# Altium schematic sheet ЦТЕА4.324.039_Э3_4.SchDoc
size 420 x 297 mm; ApprovedBy: Соколов; CheckedBy: Крушинская; DrawnBy: Бунтов; DocumentNumber: ЦТЕА4.324.039 Э3; SheetNumber: 3; SheetTotal: 4; Title1str: Плата управления; Title2str: и индикации телеметрии; ProcessInspection: Кудряшова; DocumentType1str: Схема электрическая; DocumentType2str: принципиальная; PageSetup: Record=PageOptionsZCenterHorizontal=TrueZCenterVertical=TrueZPrintScale=0.70ZXCorrection=1.00ZYCorrection=1.00ZPrintKind=1ZBorderSize=5000000ZLeftOffset=0ZBottomOffset=0ZOrientation=2ZPaperLength=2970ZPaperWidth=4200ZScale=100ZPaperSource=7ZPrintQuality=300ZMediaType=1ZDitherType=10ZPaperKind=Custom SizeZPrintScaleMode=1; ImagePath: ЦТЕА4.324.039; Rule: PcbType=ProtelPcb
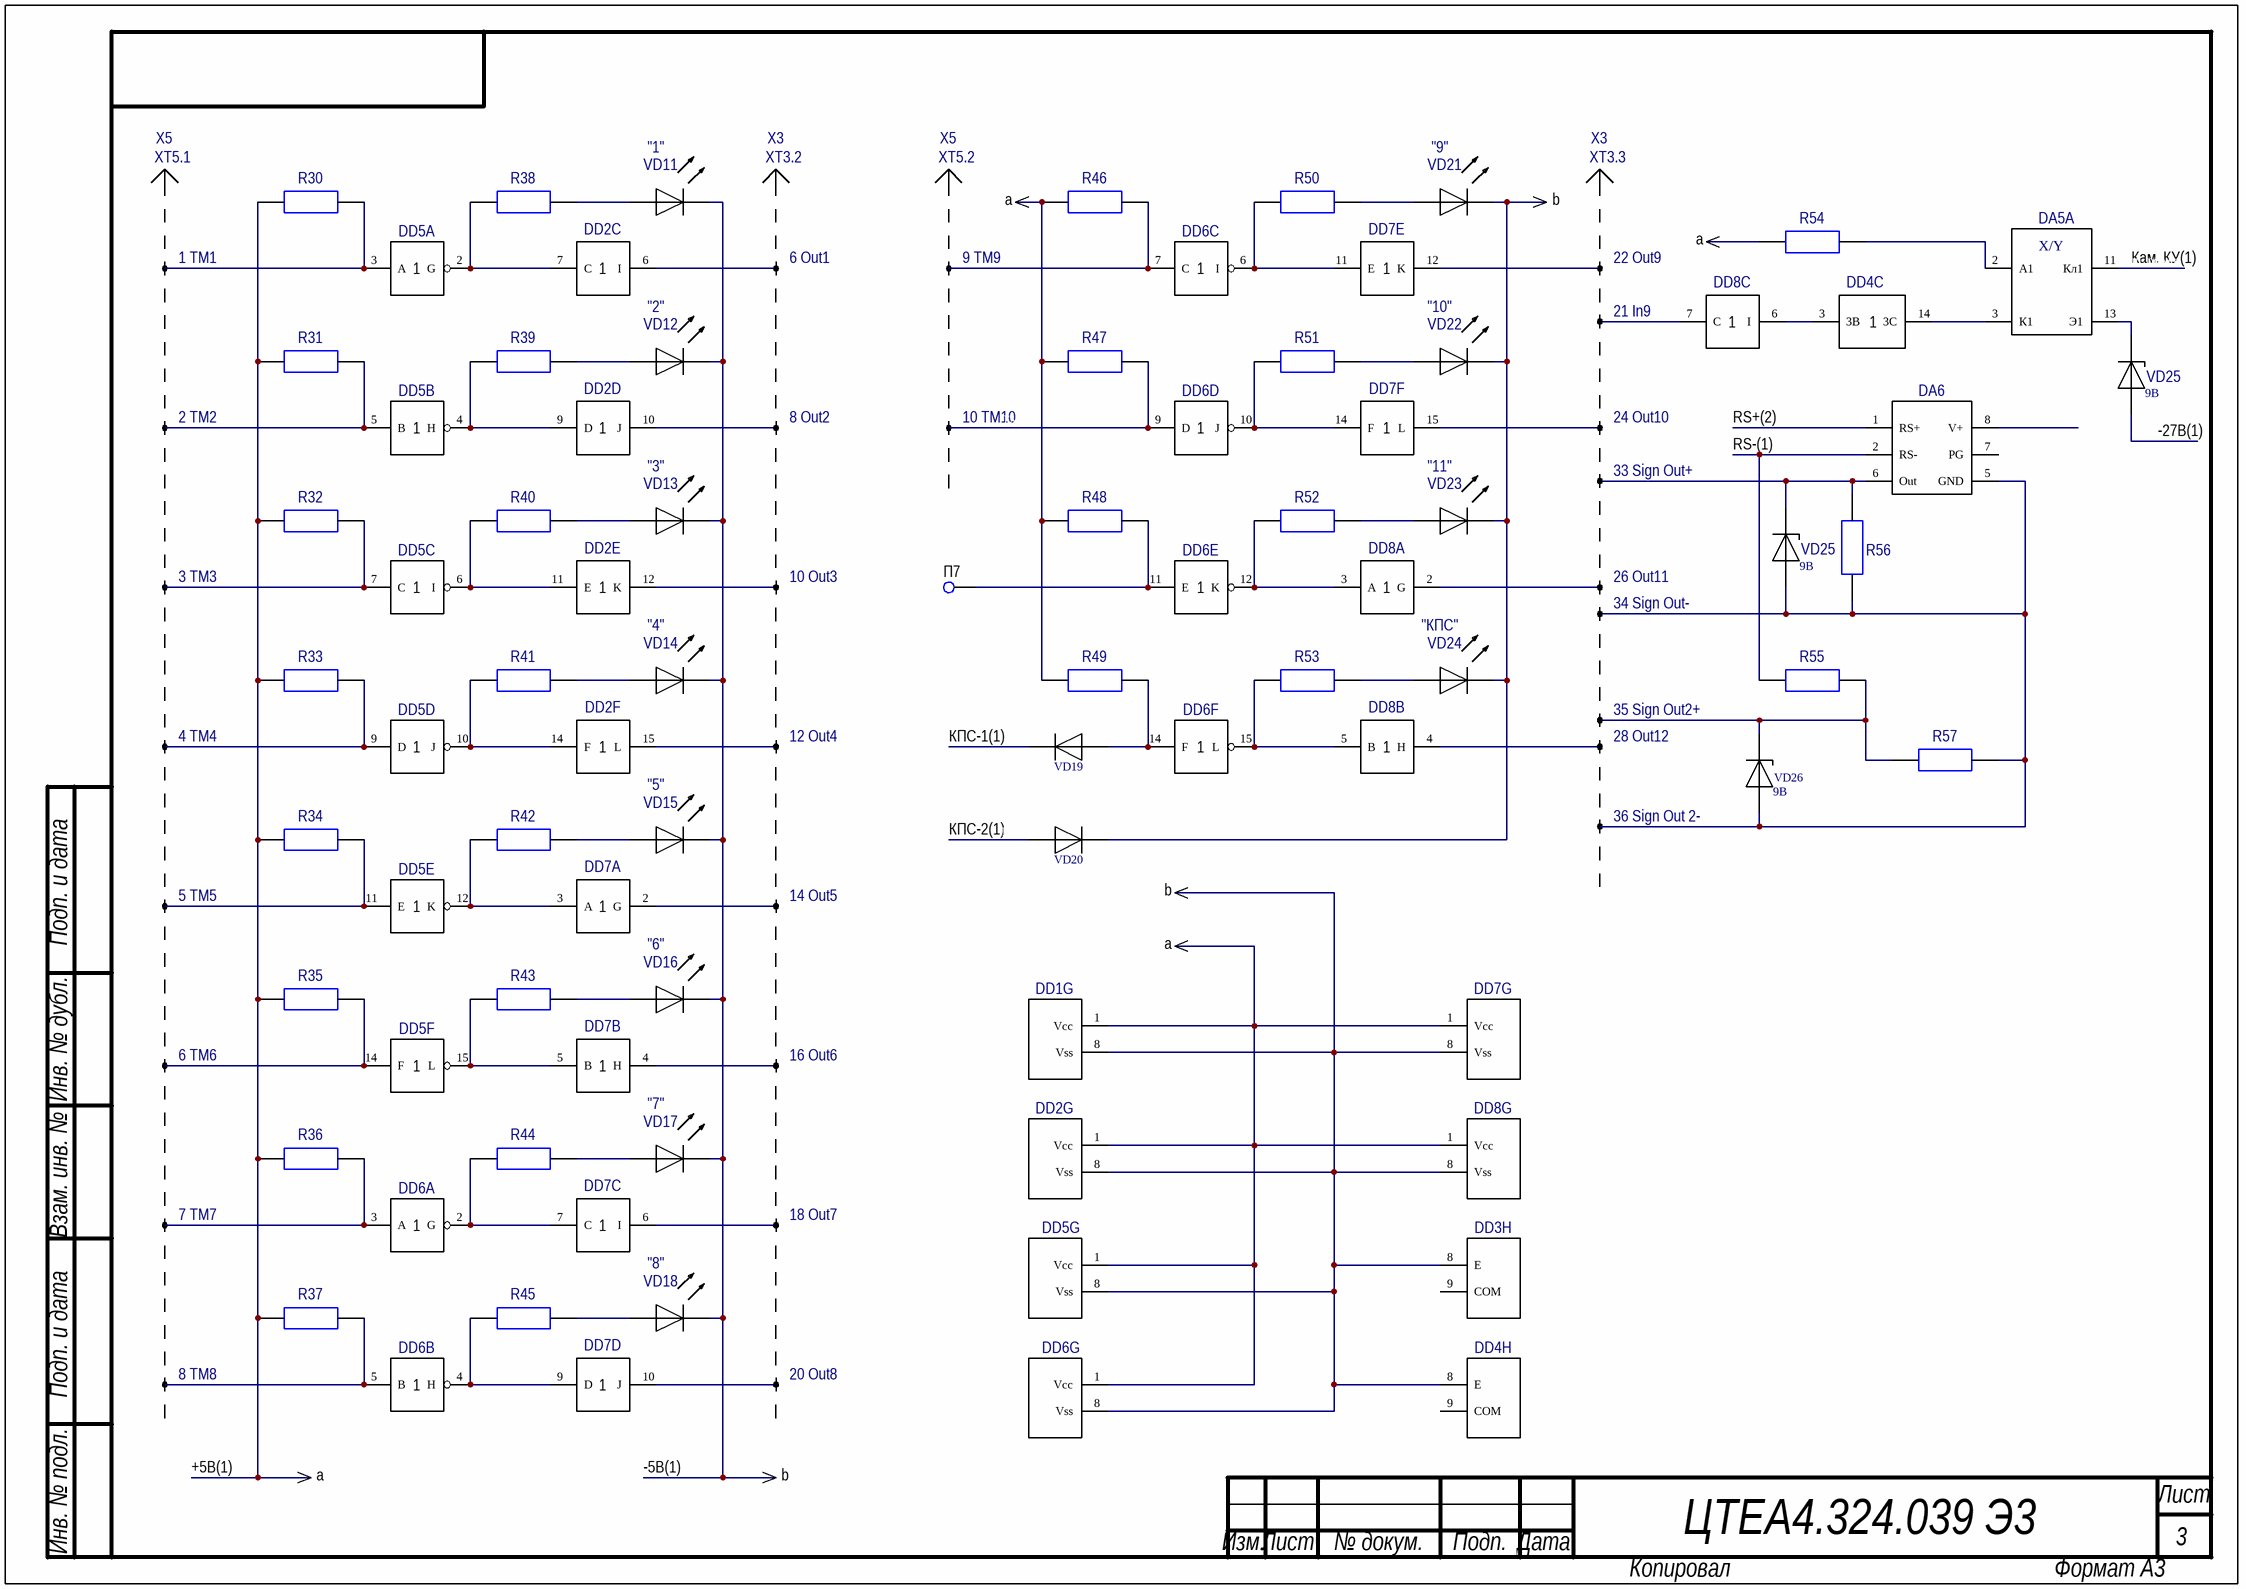
[diagram p0: ЦТЕА4.324.039_Э3_4.SchDoc]

## Parts
(Parts that share a designator on the sheet are numbered #1, #2 ... from top to bottom, then left to right.)
DA5  249КП1С  [249KP1S-44_3208_125_12]  (value not drawn)  (part A of 2)
DA6  MAX4172  [MAX4172]  (value not drawn)
DD1  Mikroshema  [CD4050BD]  (value not drawn)  (part G of 7)
DD2  Mikroshema  [CD4050BD]  (value not drawn)  (parts C,D,E,F,G of 7)
DD3  Mikroshema  [UL2004AD]  (value not drawn)  (part H of 8)
DD4  Mikroshema  [UL2004AD]  (value not drawn)  (parts C,H of 8)
DD5  CD4049  [CD4049UBD]  (value not drawn)  (parts A,B,C,D,E,F,G of 7)
DD6  CD4049  [CD4049UBD]  (value not drawn)  (parts A,B,C,D,E,F,G of 7)
DD7  Mikroshema  [CD4050BD]  (value not drawn)  (parts A,B,C,D,E,F,G of 7)
DD8  Mikroshema  [CD4050BD]  (value not drawn)  (parts A,B,C,G of 7)
R30  Res  [CR1206-JW-3301ELF]  (value not drawn)
R31  Res  [CR1206-JW-3301ELF]  (value not drawn)
R32  Res  [CR1206-JW-3301ELF]  (value not drawn)
R33  Res  [CR1206-JW-3301ELF]  (value not drawn)
R34  Res  [CR1206-JW-3301ELF]  (value not drawn)
R35  Res  [CR1206-JW-3301ELF]  (value not drawn)
R36  Res  [CR1206-JW-3301ELF]  (value not drawn)
R37  Res  [CR1206-JW-3301ELF]  (value not drawn)
R38  Res  [CR1206-JW-4700ELF]  (value not drawn)
R39  Res  [CR1206-JW-4700ELF]  (value not drawn)
R40  Res  [CR1206-JW-4700ELF]  (value not drawn)
R41  Res  [CR1206-JW-4700ELF]  (value not drawn)
R42  Res  [CR1206-JW-4700ELF]  (value not drawn)
R43  Res  [CR1206-JW-4700ELF]  (value not drawn)
R44  Res  [CR1206-JW-4700ELF]  (value not drawn)
R45  Res  [CR1206-JW-4700ELF]  (value not drawn)
R46  Res  [CR1206-JW-3301ELF]  (value not drawn)
R47  Res  [CR1206-JW-3301ELF]  (value not drawn)
R48  Res  [CR1206-JW-3301ELF]  (value not drawn)
R49  Res  [CR1206-JW-3301ELF]  (value not drawn)
R50  Res  [CR1206-JW-4700ELF]  (value not drawn)
R51  Res  [CR1206-JW-4700ELF]  (value not drawn)
R52  Res  [CR1206-JW-4700ELF]  (value not drawn)
R53  Res  [CR1206-JW-4700ELF]  (value not drawn)
R54  Res  [CR1206-JW-3300ELF]  (value not drawn)
R55  Res  [CR1206-JW-4701ELF]  (value not drawn)
R56  Res  [CR1206-JW-1001ELF]  (value not drawn)
R57  Res  [CR1206-JW-4700ELF]  (value not drawn)
VD11  "1"  [HLMP-D150]
VD12  "2"  [HLMP-D150]
VD13  "3"  [HLMP-D150]
VD14  "4"  [HLMP-D150]
VD15  "5"  [HLMP-D150]
VD16  "6"  [HLMP-D150]
VD17  "7"  [HLMP-D150]
VD18  "8"  [HLMP-D150]
VD19  Schottky  [10MQ060N]  (value not drawn)
VD20  Schottky  [10MQ060N]  (value not drawn)
VD21  "9"  [HLMP-D150]
VD22  "10"  [HLMP-D150]
VD23  "11"  [HLMP-D150]
VD24  "КПС"  [HLMP-D150]
VD25#1  9В  [1N4754A-1_0000_100]
VD25#2  9В  [1N4754A-1_0000_100]
VD26  9В  [1N4754A-1_0000_100]
XT3  6 Out1  [PLD-40]  (parts F,H,J,L,N,P,R,T,U,V,X,Z,28,33,34,35,36 of 40)
XT5  1 ТМ1  [PLD-16]  (parts A,B,C,D,E,F,G,H,I,J of 16)
П7  (no value)  [Pad]

## Nets
+5V: DD1.1(Vcc) DD2.1(Vcc) DD5.1(Vcc) DD6.1(Vcc) DD7.1(Vcc) DD8.1(Vcc) R30.1 R31.1 R32.1 R33.1 R34.1 R35.1 R36.1 R37.1 R46.1 R47.1 R48.1 R49.1 R54.1
+27В: DA6.8(V+)
+27В_кам_RS+: DA6.1(RS+)
+27В_кам_RS-: DA6.2(RS-) R55.1
-27В: DA6.5(GND) R56.1 R57.2 VD25#1.1(A) VD25#2.1(A) VD26.1(A) XT3.34 XT3.36
Cam_power: DA5.11(Кл1)
GND: DD1.8(Vss) DD2.8(Vss) DD3.8(E) DD4.8(E) DD5.8(Vss) DD6.8(Vss) DD7.8(Vss) DD8.8(Vss) VD11.2(C) VD12.2(C) VD13.2(C) VD14.2(C) VD15.2(C) VD16.2(C) VD17.2(C) VD18.2(C) VD20.2(C) VD21.2(C) VD22.2(C) VD23.2(C) VD24.2(C)
NetLabel7: DD2.7(C) DD2.9(D) DD2.11(E) DD2.14(F) DD5.2(G) DD5.4(H) DD5.6(I) DD5.10(J) DD5.12(K) DD5.15(L) DD6.2(G) DD6.4(H) DD6.6(I) DD6.10(J) DD6.12(K) DD6.15(L) DD7.3(A) DD7.5(B) DD7.7(C) DD7.9(D) DD7.11(E) DD7.14(F) DD8.3(A) DD8.5(B) R38.1 R39.1 R40.1 R41.1 R42.1 R43.1 R44.1 R45.1 R50.1 R51.1 R52.1 R53.1
КПС-1: VD19.2(C)
КПС-2: VD20.1(A)
ТМ1: DD5.3(A) R30.2 XT5.1
ТМ2: DD5.5(B) R31.2 XT5.2
ТМ3: DD5.7(C) R32.2 XT5.3
ТМ4: DD5.9(D) R33.2 XT5.4
ТМ5: DD5.11(E) R34.2 XT5.5
ТМ6: DD5.14(F) R35.2 XT5.6
ТМ7: DD6.3(A) R36.2 XT5.7
ТМ8: DD6.5(B) R37.2 XT5.8
ТМ9: DD6.7(C) R46.2 XT5.9
ТМ10: DD6.9(D) R47.2 XT5.10
NetDA5_2: DA5.2(А1) R54.2
NetDA5_3: DA5.3(К1) DD4.14(3C)
NetDA5_13: DA5.13(Э1) VD25#1.2(C)
NetDA6_6: DA6.6(Out) R56.2 VD25#2.2(C) XT3.33
NetDD2_6: DD2.6(I) XT3.6
NetDD2_10: DD2.10(J) XT3.8
NetDD2_12: DD2.12(K) XT3.10
NetDD2_15: DD2.15(L) XT3.12
NetDD4_3: DD4.3(3B) DD8.6(I)
NetDD6_11: DD6.11(E) R48.2 П7.1
NetDD6_14: DD6.14(F) R49.2 VD19.1(A)
NetDD7_2: DD7.2(G) XT3.14
NetDD7_4: DD7.4(H) XT3.16
NetDD7_6: DD7.6(I) XT3.18
NetDD7_10: DD7.10(J) XT3.20
NetDD7_12: DD7.12(K) XT3.22
NetDD7_15: DD7.15(L) XT3.24
NetDD8_2: DD8.2(G) XT3.26
NetDD8_4: DD8.4(H) XT3.28
NetDD8_7: DD8.7(C) XT3.21
NetR38_2: R38.2 VD11.1(A)
NetR39_2: R39.2 VD12.1(A)
NetR40_2: R40.2 VD13.1(A)
NetR41_2: R41.2 VD14.1(A)
NetR42_2: R42.2 VD15.1(A)
NetR43_2: R43.2 VD16.1(A)
NetR44_2: R44.2 VD17.1(A)
NetR45_2: R45.2 VD18.1(A)
NetR50_2: R50.2 VD21.1(A)
NetR51_2: R51.2 VD22.1(A)
NetR52_2: R52.2 VD23.1(A)
NetR53_2: R53.2 VD24.1(A)
NetR55_2: R55.2 R57.1 VD26.2(C) XT3.35

Not connected (* = marked no-connect by the designer): DA6 7(PG); DD3 9(COM); DD4 9(COM)

## Notes on the sheet
- XT5.1
- X5
- XT3.2
- X3
- XT5.2
- XT3.3
- a
- b
- (near DA5) Кам. КУ(1)
- RS-(1)
- RS+(2)
- (near VD25#1) -27В(1)
- (near VD19) КПС-1(1)
- (near VD20) КПС-2(1)
- +5В(1)
- -5В(1)
- Подп. и дата
- Инв. № дубл.
- Взам. инв. №
- Инв. № подл.
- Лист
- Изм.
- № докум.
- Подп.
- Дата
- Копировал
- Формат А3
- (in symbol Microshema, part A) Х/Y

## Library data of the parts
DA5 = Microshema
DD1 DD2 DD7 DD8 = Mikroshema: CD4050BD
DD3 DD4 = Mikroshema: ULN2004
DD5 DD6 = Mikroshema
R30-R57 = Rezistor
VD11-VD18 VD21-VD24 = Svetodiod
VD19 VD20 = Diod
VD25#1 VD25#2 VD26 = Diod: zener
XT3 = Razem shtyrevoj: Наименование: *; Название: *
XT5 = Razem shtyrevoj: PLD16; Наименование: *; Название: *
П7 = Pad